# Altium schematic sheet 10_Clock.SchDoc: Clock (part 1 of 2)
size A3; Organization: Lime Microsystems; Address1: Surrey Tech Centre; Address2: Guildford GU2 7YG; Address3: Surrey; Address4: United Kingdom; SheetNumber: 10
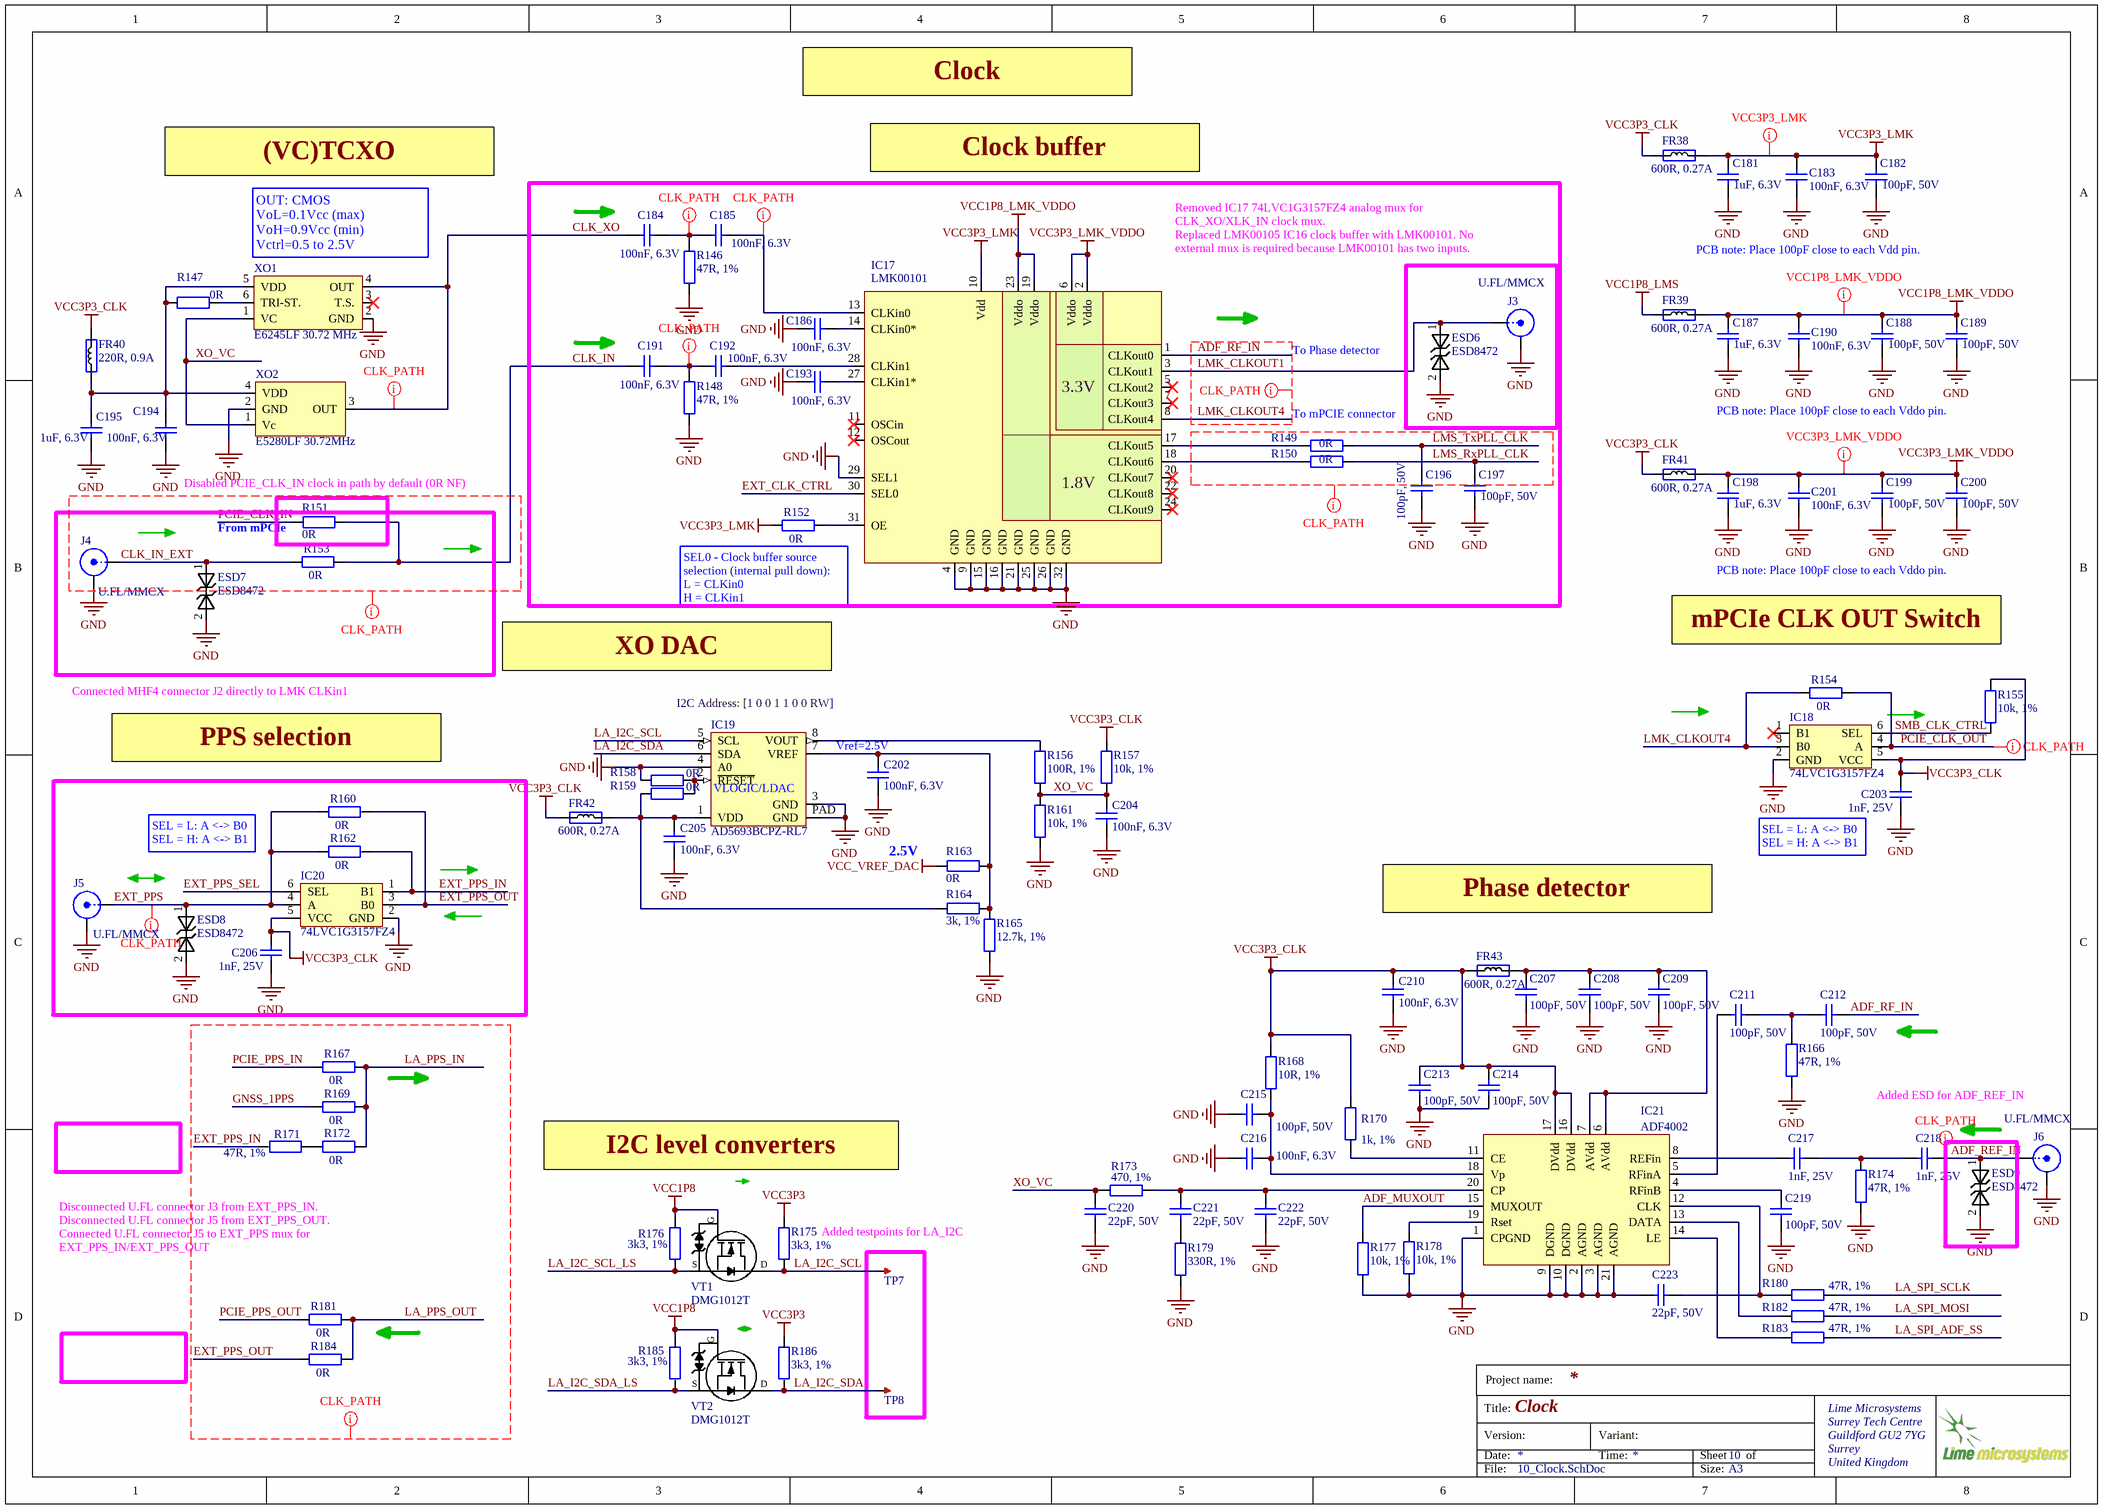
[diagram p0: 10_Clock.SchDoc]

## Parts
C181  1uF, 6.3V  [CAP0201]
C182  100pF, 50V  [CAP0201]
C183  100nF, 6.3V  [CAP0201]
C184  100nF, 6.3V  [CAP0201]
C185  100nF, 6.3V  [CAP0201]
C186  100nF, 6.3V  [CAP0201]
C187  1uF, 6.3V  [CAP0201]
C188  100pF, 50V  [CAP0201]
C189  100pF, 50V  [CAP0201]
C190  100nF, 6.3V  [CAP0201]
C191  100nF, 6.3V  [CAP0201]
C192  100nF, 6.3V  [CAP0201]
C193  100nF, 6.3V  [CAP0201]
C194  100nF, 6.3V  [CAP0201]
C195  1uF, 6.3V  [CAP0201]
C196  100pF, 50V  [CAP0201]
C197  100pF, 50V  [CAP0201]
C198  1uF, 6.3V  [CAP0201]
C199  100pF, 50V  [CAP0201]
C200  100pF, 50V  [CAP0201]
C201  100nF, 6.3V  [CAP0201]
C202  100nF, 6.3V  [CAP0201]
C203  1nF, 25V  [CAP0201]
C204  100nF, 6.3V  [CAP0201]
C205  100nF, 6.3V  [CAP0201]
C206  1nF, 25V  [CAP0201]
C207  100pF, 50V  [CAP0201]
C208  100pF, 50V  [CAP0201]
C209  100pF, 50V  [CAP0201]
C210  100nF, 6.3V  [CAP0201]
C211  100pF, 50V  [CAP0201]
C212  100pF, 50V  [CAP0201]
C213  100pF, 50V  [CAP0201]
C214  100pF, 50V  [CAP0201]
C215  100pF, 50V  [CAP0201]
C216  100nF, 6.3V  [CAP0201]
C217  1nF, 25V  [CAP0201]
C218  1nF, 25V  [CAP0201]
C219  100pF, 50V  [CAP0201]
C220  22pF, 50V  [CAP0201]
C221  22pF, 50V  [CAP0201]
C222  22pF, 50V  [CAP0201]
C223  22pF, 50V  [CAP0201]
ESD6  ESD8472  [ESD8472_X3DFN2]
ESD7  ESD8472  [ESD8472_X3DFN2]
ESD8  ESD8472  [ESD8472_X3DFN2]
ESD9  ESD8472  [ESD8472_X3DFN2]
FR38  600R, 0.27A  [RES0201]
FR39  600R, 0.27A  [RES0201]
FR40  220R, 0.9A  [RES0402]
FR41  600R, 0.27A  [RES0201]
FR42  600R, 0.27A  [RES0201]
FR43  600R, 0.27A  [RES0201]
IC17  LMK00101  [LMK00101_WQFN32]
IC18  74LVC1G3157FZ4  [74LVC1G3157FZ4_SPDT_SW_DFN1410-6]
IC19  AD5693BCPZ-RL7  [AD5693RACPZ-1RL7_DAC_8LFCSP]
IC20  74LVC1G3157FZ4  [74LVC1G3157FZ4_SPDT_SW_DFN1410-6]
IC21  ADF4002  [ADF4002]
J3  U.FL/MMCX  [MMCX_UFL_conn_u_v2]
J4  U.FL/MMCX  [MMCX_UFL_conn_u_v2]
J5  U.FL/MMCX  [MMCX_UFL_conn_u_v2]
J6  U.FL/MMCX  [MMCX_UFL_conn_u_v2]
R146  47R, 1%  [RES0201]
R147  0R  [RES0402]
R148  47R, 1%  [RES0201]
R149  0R  [RES0201]
R150  0R  [RES0201]
R151  0R  [RES0201]
R152  0R  [RES0201]
R153  0R  [RES0201]
R154  0R  [RES0201]
R155  10k, 1%  [RES0201]
R156  100R, 1%  [RES0201]
R157  10k, 1%  [RES0201]
R158  0R  [RES0201]
R159  0R  [RES0201]
R160  0R  [RES0201]
R161  10k, 1%  [RES0201]
R162  0R  [RES0201]
R163  0R  [RES0201]
R164  3k, 1%  [RES0201]
R165  12.7k, 1%  [RES0201]
R166  47R, 1%  [RES0201]
R167  0R  [RES0201]
R168  10R, 1%  [RES0201]
R169  0R  [RES0201]
R170  1k, 1%  [RES0201]
R171  47R, 1%  [RES0201]
R172  0R  [RES0201]
R173  470, 1%  [RES0201]
R174  47R, 1%  [RES0201]
R175  3k3, 1%  [RES0201]
R176  3k3, 1%  [RES0201]
R177  10k, 1%  [RES0201]
R178  10k, 1%  [RES0201]
R179  330R, 1%  [RES0201]
R180  47R, 1%  [RES0201]
R181  0R  [RES0201]
R182  47R, 1%  [RES0201]
R183  47R, 1%  [RES0201]
R184  0R  [RES0201]
R185  3k3, 1%  [RES0201]
R186  3k3, 1%  [RES0201]
TP7  TESTPOINT_PAD  [TP_PAD_1MM]  (value not drawn)  (no BOM)
TP8  TESTPOINT_PAD  [TP_PAD_1MM]  (value not drawn)  (no BOM)
VT1  DMG1012T  [SOT523]
VT2  DMG1012T  [SOT523]
XO1  E6245LF 30.72 MHz  [RAKON_RPT7050A]
XO2  E5280LF 30.72MHz  [RAKON_TXCO]

## Blocks framed on the sheet
From mPCIe: ESD7 J4 R151 R153

## Nets
GND: C181.2 C182.1 C183.1 C186.1 C187.2 C188.1 C189.1 C190.1 C193.1 C194.2 C195.2 C196.1 C197.1 C198.2 C199.1 C200.1 C201.1 C202.2 C203.1 C204.2 C205.2 C206.1 C207.1 C208.1 C209.1 C210.2 C213.1 C214.1 C215.2 C216.1 C219.1 C220.1 C222.1 C223.2 ESD6.2 ESD7.2 ESD8.2 ESD9.2 IC17.4(GND) IC17.9(GND) IC17.15(GND) IC17.16(GND) IC17.21(GND) IC17.25(GND) IC17.26(GND) IC17.29(SEL1) IC17.32(GND) IC18.2(GND) IC19.3(GND) IC19.4(A0) IC19.PAD(GND) IC20.2(GND) IC21.1(CPGND) IC21.2(AGND) IC21.3(AGND) IC21.9(DGND) IC21.10(DGND) IC21.21(AGND) J3.2(Y) J4.2(Y) J5.2(Y) J6.2(Y) R146.2 R148.2 R158.1 R161.2 R165.2 R166.2 R174.1 R177.2 R178.2 R179.2 XO1.2(GND) XO2.2(GND)
VCC1P8: R176.1 R185.1 VT1.G VT2.G
VCC1P8_LMK_VDDO: C187.1 C188.2 C189.2 C190.2 FR39.2 IC17.19(Vddo) IC17.23(Vddo)
VCC1P8_LMS: FR39.1
VCC3P3: R175.1 R186.1
VCC3P3_CLK: C203.2 C206.2 C210.1 C213.2 C214.2 FR38.1 FR40.2 FR41.1 FR42.1 FR43.1 IC18.5(VCC) IC20.5(VCC) IC21.16(DVdd) IC21.17(DVdd) R155.2 R157.1 R168.2 R170.1
VCC3P3_LMK: C181.1 C182.2 C183.2 FR38.2 IC17.10(Vdd) R152.1
VCC3P3_LMK_VDDO: C198.1 C199.2 C200.2 C201.2 FR41.2 IC17.2(Vddo) IC17.6(Vddo)
VCC_VREF_DAC: R163.2
ADF_MUXOUT: IC21.15(MUXOUT) R177.1
ADF_REF_IN: C218.2 ESD9.1 J6.1(X)
ADF_RF_IN: C212.1 IC17.1(CLKout0)
CLK_IN: C191.2 R151.1 R153.2
CLK_IN_EXT: ESD7.1 J4.1(X) R153.1
CLK_XO: C184.2 XO1.4(OUT) XO2.3(OUT)
EXT_CLK_CTRL: IC17.30(SEL0)
EXT_PPS: ESD8.1 IC20.4(A) J5.1(X) R160.1 R162.1
EXT_PPS_IN: IC20.1(B1) R162.2 R171.2
EXT_PPS_OUT: IC20.3(B0) R160.2 R184.1
EXT_PPS_SEL: IC20.6(SEL)
GNSS_1PPS: R169.1
LA_I2C_SCL: IC19.5(SCL) R175.2 TP7.1 VT1.D
LA_I2C_SCL_LS: R176.2 VT1.S
LA_I2C_SDA: IC19.6(SDA) R186.2 TP8.1 VT2.D
LA_I2C_SDA_LS: R185.2 VT2.S
LA_PPS_IN: R167.2 R169.2 R172.2
LA_PPS_OUT: R181.2 R184.2
LA_SPI_ADF_SS: R183.2
LA_SPI_MOSI: R182.2
LA_SPI_SCLK: R180.2
LMK_CLKOUT1: ESD6.1 IC17.3(CLKout1) J3.1(X)
LMK_CLKOUT4: IC17.8(CLKout4) IC18.3(B0) R154.1
LMS_RxPLL_CLK: C197.2 R150.2
LMS_TxPLL_CLK: C196.2 R149.2
PCIE_CLK_IN: R151.2
PCIE_CLK_OUT: IC18.4(A) R154.2
PCIE_PPS_IN: R167.1
PCIE_PPS_OUT: R181.1
SMB_CLK_CTRL: IC18.6(SEL) R155.1
XO_VC: C204.1 C220.2 R156.2 R157.2 R161.1 R173.1 XO1.1(VC) XO2.1(Vc)
NetC184_1: C184.1 C185.1 R146.1
NetC185_2: C185.2 IC17.13(CLKin0)
NetC186_2: C186.2 IC17.14(CLKin0*)
NetC191_1: C191.1 C192.1 R148.1
NetC192_2: C192.2 IC17.28(CLKin1)
NetC193_2: C193.2 IC17.27(CLKin1*)
NetC194_1: C194.1 C195.1 FR40.1 R147.2 XO1.5(VDD) XO2.4(VDD)
NetC202_1: C202.1 IC19.7(VREF) R163.1 R164.1 R165.1
NetC205_1: C205.1 FR42.2 IC19.1(VDD) R159.1 R164.2
NetC207_2: C207.2 C208.2 C209.2 FR43.2 IC21.6(AVdd) IC21.7(AVdd)
NetC211_1: C211.1 C212.2 R166.1
NetC211_2: C211.2 IC21.5(RFinA)
NetC215_1: C215.1 C216.2 IC21.18(Vp) R168.1
NetC217_1: C217.1 IC21.8(REFin)
NetC217_2: C217.2 C218.1 R174.2
NetC219_2: C219.2 IC21.4(RFinB)
NetC221_1: C221.1 R179.1
NetC221_2: C221.2 C222.2 IC21.20(CP) R173.2
NetC223_1: C223.1 IC21.12(CLK) R180.1
NetIC17_17: IC17.17(CLKout5) R149.1
NetIC17_18: IC17.18(CLKout6) R150.1
NetIC17_31: IC17.31(OE) R152.2
NetIC19_2: IC19.2(~{RESET}) R158.2 R159.2
NetIC19_8: IC19.8(VOUT) R156.1
NetIC21_11: IC21.11(CE) R170.2
NetIC21_13: IC21.13(DATA) R182.1
NetIC21_14: IC21.14(LE) R183.1
NetIC21_19: IC21.19(Rset) R178.1
NetR147_1: R147.1 XO1.6(TRI-ST.)
NetR171_1: R171.1 R172.1

Not connected (* = marked no-connect by the designer): IC17 5(CLKout2)* 7(CLKout3)* 11(OSCin)* 12(OSCout)* 20(CLKout7)* 22(CLKout8)* 24(CLKout9)*; IC18 1(B1)*; XO1 3(T.S.)*

## Layout directives
net class CLK_PATH: ADF_REF_IN, ADF_RF_IN, CLK_IN_EXT, CLK_XO, EXT_PPS, EXT_PPS_IN, EXT_PPS_OUT, GND, GNSS_1PPS, LA_PPS_IN, LA_PPS_OUT, LMK_CLKOUT1, LMK_CLKOUT4, LMS_RxPLL_CLK, LMS_TxPLL_CLK, NetC184_1, NetC185_2, NetC191_1, PCIE_CLK_IN, PCIE_CLK_OUT, PCIE_PPS_IN, PCIE_PPS_OUT
net class VCC3P3_LMK: VCC3P3_LMK
net class VCC3P3_LMKRF: VCC1P8_LMK_VDDO
net class VCC3P3_LMK_VDDO: VCC3P3_LMK_VDDO

## Notes on the sheet
- Clock
- (VC)TCXO
- Clock buffer
- (near XO1) OUT: CMOS
  VoL=0.1Vcc (max)
  VoH=0.9Vcc (min)
  Vctrl=0.5 to 2.5V
- (near IC17) Removed IC17 74LVC1G3157FZ4 analog mux for CLK_XO/XLK_IN clock mux.
  Replaced LMK00105 IC16 clock buffer with LMK00101. No external mux is required because LMK00101 has two inputs.
  Connected U.FL connector J3 directly to LMK_CLKOUT1
- PCB note: Place 100pF close to each Vdd pin.
- (near ESD6) To Phase detector
- (near IC17) 3.3V
- To mPCIE connector
- PCB note: Place 100pF close to each Vddo pin.
- (near IC17) 1.8V
- (near R151) Disabled PCIE_CLK_IN clock in path by default (0R NF)
- SEL0 - Clock buffer source selection (internal pull down):
  L = CLKin0
  H = CLKin1
- mPCIe CLK OUT Switch
- XO DAC
- (near IC19) I2C Address: [1 0 0 1 1 0 0 RW]
- Connected MHF4 connector J2 directly to LMK CLKin1
- (near R160) PPS selection
- (near C202) Vref=2.5V
- SEL = L: A <-> B0
  SEL = H: A <-> B1
- (near IC19) VLOGIC/LDAC
- (near R163) 2.5V
- Phase detector
- I2C level converters
- Added ESD for ADF_REF_IN
- Disconnected U.FL connector J3 from EXT_PPS_IN.
  Disconnected U.FL connector J5 from EXT_PPS_OUT.
  Connected U.FL connector J5 to EXT_PPS mux for
  EXT_PPS_IN/EXT_PPS_OUT
- (near TP7) Added testpoints for LA_I2C
- Project name:
- Title:
- Version:
- Date:
- Variant:
- Time:
- Sheet
- of
- File:
- Size:
- A3